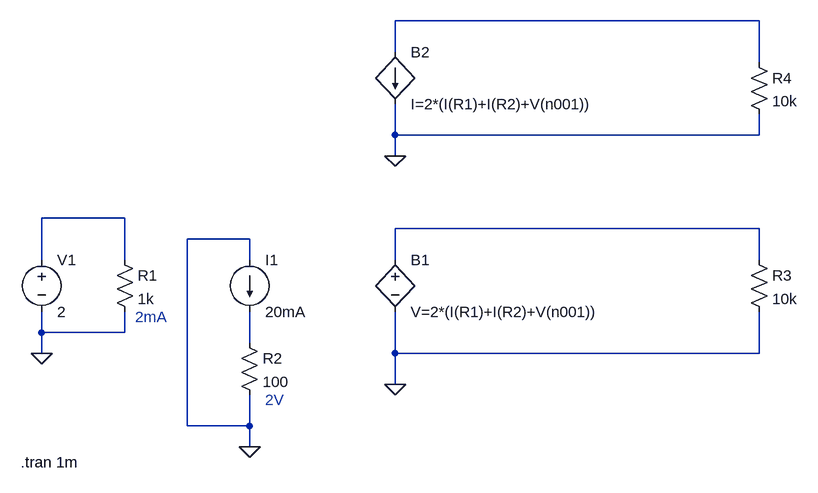
[diagram p0: schematic VoltageSource_Behavioral .asc]
VoltageSource_Behavioral .asc, the LTspice schematic file:
Version 4.1
SHEET 1 880 680
WIRE 768 -208 208 -208
WIRE 208 -160 208 -208
WIRE 768 -144 768 -208
WIRE 208 -32 208 -80
WIRE 768 -32 768 -64
WIRE 768 -32 208 -32
WIRE 208 0 208 -32
WIRE -208 96 -336 96
WIRE 768 112 208 112
WIRE -16 128 -112 128
WIRE -336 160 -336 96
WIRE -208 160 -208 96
WIRE -16 160 -16 128
WIRE 208 160 208 112
WIRE 768 160 768 112
WIRE -336 272 -336 240
WIRE -208 272 -208 240
WIRE -208 272 -336 272
WIRE -16 288 -16 240
WIRE -336 304 -336 272
WIRE 208 304 208 240
WIRE 768 304 768 240
WIRE 768 304 208 304
WIRE 208 352 208 304
WIRE -112 416 -112 128
WIRE -16 416 -16 368
WIRE -16 416 -112 416
WIRE -16 448 -16 416
FLAG -16 448 0
FLAG -336 304 0
FLAG 208 352 0
FLAG 208 0 0
SYMBOL bv 208 144 R0
SYMATTR InstName B1
SYMATTR Value V=2*(I(R1)+I(R2)+V(n001))
SYMBOL voltage -336 144 R0
WINDOW 123 0 0 Left 0
WINDOW 39 0 0 Left 0
SYMATTR InstName V1
SYMATTR Value 2
SYMBOL res -224 144 R0
SYMATTR InstName R1
SYMATTR Value 1k
SYMBOL current -16 160 R0
WINDOW 123 0 0 Left 0
WINDOW 39 0 0 Left 0
SYMATTR InstName I1
SYMATTR Value 20mA
SYMBOL res -32 272 R0
SYMATTR InstName R2
SYMATTR Value 100
SYMBOL res 752 144 R0
SYMATTR InstName R3
SYMATTR Value 10k
SYMBOL bi 208 -160 R0
SYMATTR InstName B2
SYMATTR Value I=2*(I(R1)+I(R2)+V(n001))
SYMBOL res 752 -160 R0
SYMATTR InstName R4
SYMATTR Value 10k
TEXT -192 248 Left 2 ;2mA
TEXT 8 376 Left 2 ;2V
TEXT -368 472 Left 2 !.tran 1m

The netlist it stands for:
* VoltageSource_Behavioral .asc
B1 N003 0 V=2*(I(R1)+I(R2)+V(n001))
V1 N002 0 2
R1 N002 0 1k
I1 0 N004 20mA
R2 N004 0 100
R3 N003 0 10k
B2 N001 0 I=2*(I(R1)+I(R2)+V(n001))
R4 N001 0 10k
* 2mA
* 2V
.tran 1m
.backanno
.end